# Altium schematic sheet 02 Table of Content.SchDoc: CM4 IO
size 297 x 209 mm; Page Create Date: March  8, 1995; Page Number: 2; Page Size: A4; Comment: radxa_1010; Page Count: 19; RevCode: V1.10; Doc: 02 Table of Content; DsnPath: D:\WMS\黄工\[RC126]CM4_IO_V1.10\[RC126]_V1.10\CM4 IO_V1.10.DSN; SchematicName: CM4 IO V1.10; PageName: 02 Table of Content; PageSize: A4; TopSchematic: True
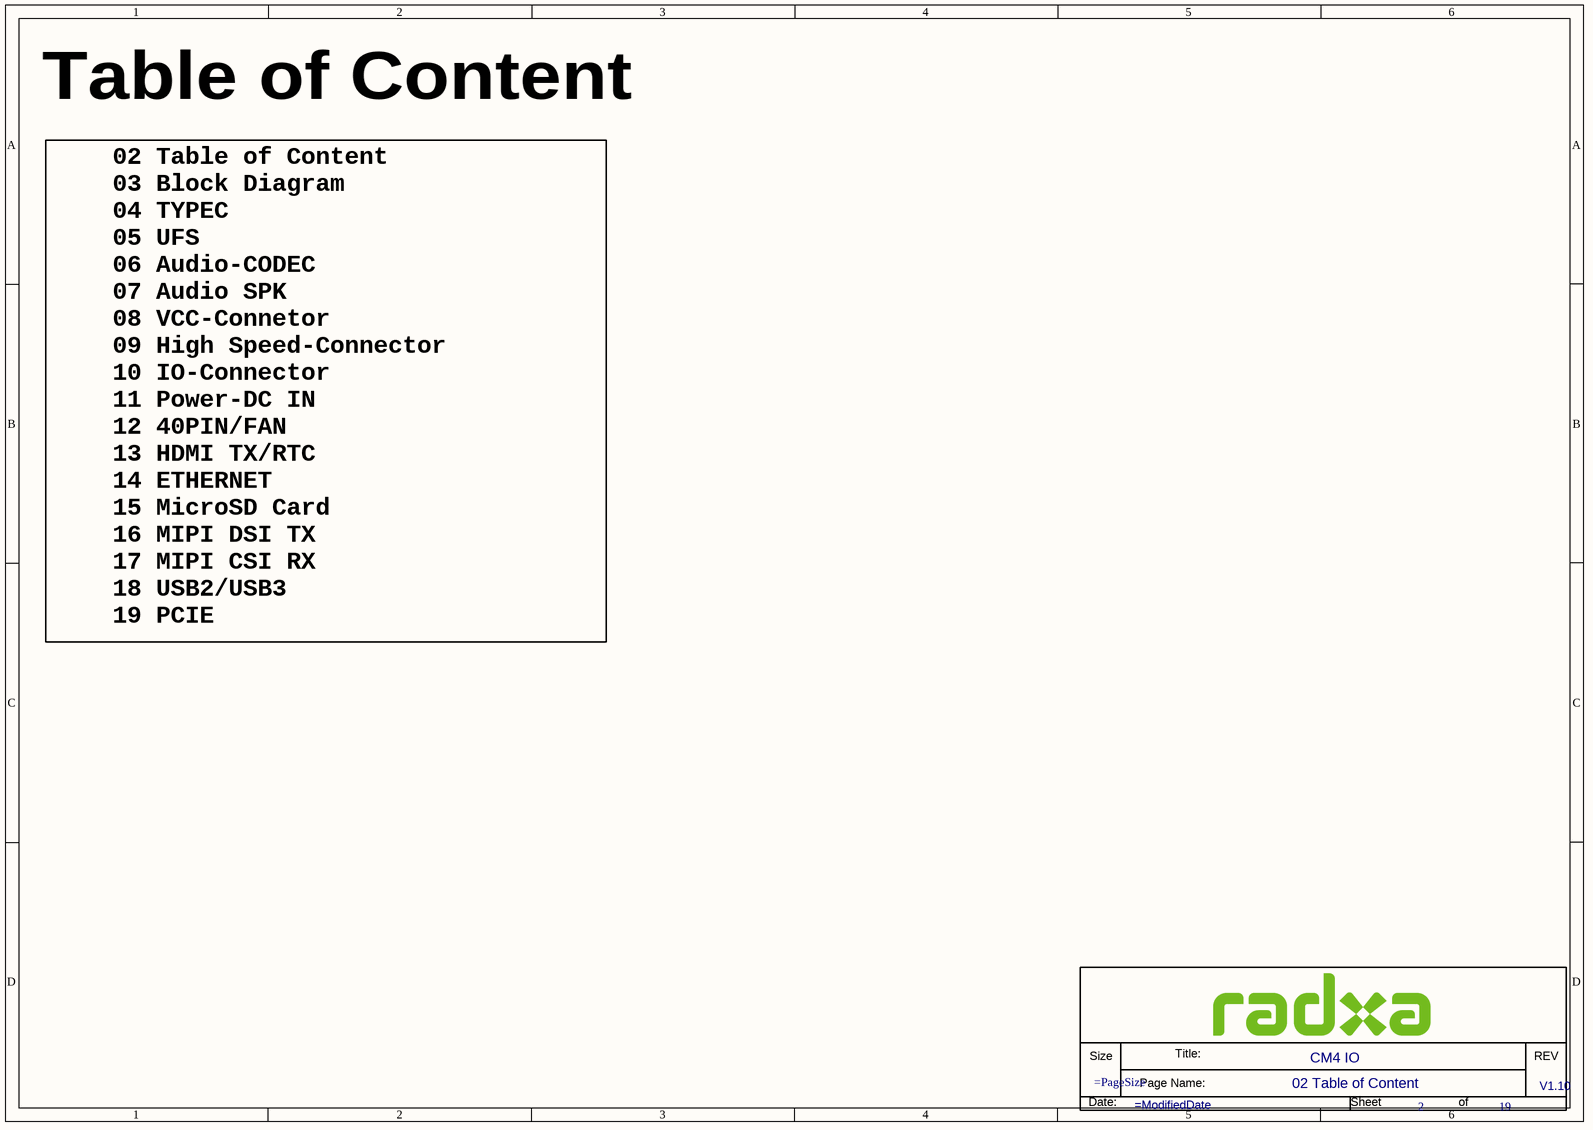
[diagram p0: 02 Table of Content.SchDoc]

## Parts
*  Doc: 02 Table of Content  RevCode: V1.10  Title: CM4 IO  Page Number: 2  Page Count: 19  (hidden comment: radxa_1010)  (graphical)

## Notes on the sheet
- Table of Content
- 02 Table of Content
  03 Block Diagram
  04 TYPEC
  05 UFS
  06 Audio-CODEC
  07 Audio SPK
  08 VCC-Connetor
  09 High Speed-Connector
  10 IO-Connector
  11 Power-DC IN
  12 40PIN/FAN
  13 HDMI TX/RTC
  14 ETHERNET
  15 MicroSD Card
  16 MIPI DSI TX
  17 MIPI CSI RX
  18 USB2/USB3
  19 PCIE
- (in symbol radxa_1010) Title:; Size; REV; Page Name:; Date:; Sheet; of

## Library data of the parts
* = radxa_1010: Page Create Date: March  8, 1995; Page Size: =PageSize; Page Modify Date: =ModifiedDate